# Altium schematic sheet top_level.SchDoc: Test
size A4; DrawnBy: Łukasz Przeniosło; Organization: Zachodniopomorski; Address1: Uniwersytet Technologiczny; Address2: w Szczecinie; Address3: Wydział Elektryczny; DocumentNumber: 1; Revision: 1.0; SheetNumber: 1; SheetTotal: 8
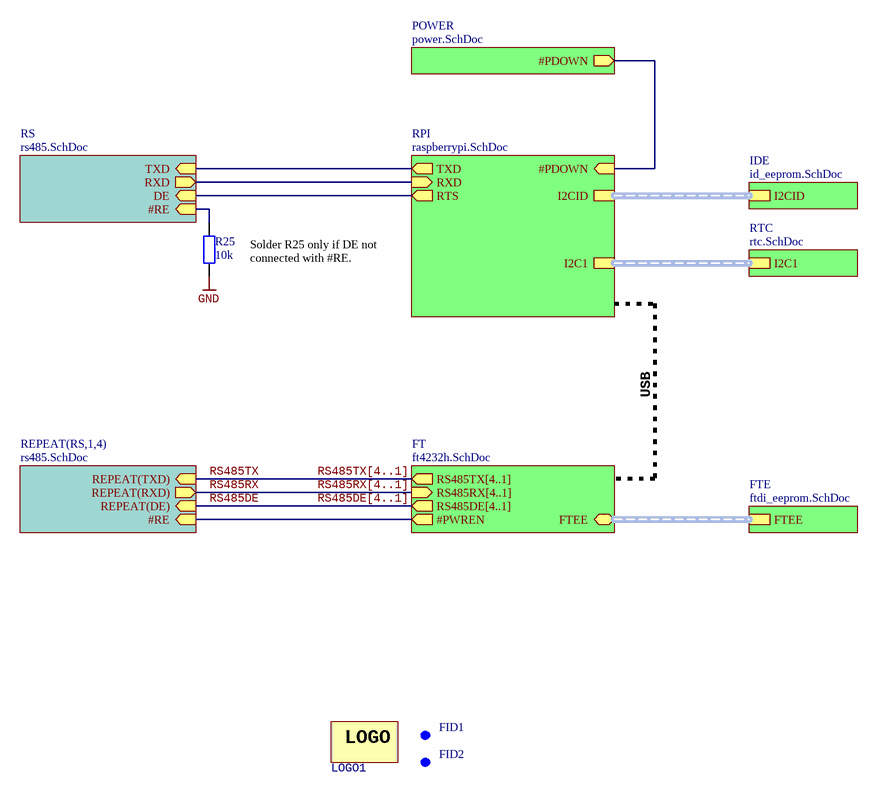
[diagram p0: top_level.SchDoc]

## Parts
FID1  Fiducial  [Fid Round]  (value not drawn)  (no BOM)
FID2  Fiducial  [Fid Round]  (value not drawn)  (no BOM)
LOGO1  Logo  [LOGO_BEMKO]  (value not drawn)
R25  10k  [RESC1005N]

## Sub-sheets
FT = ft4232h.SchDoc: RS485TX[4..1] (out), RS485RX[4..1] (in), #PWREN (out), FTEE (harness FTEE), RS485DE[4..1] (out)
FTE = ftdi_eeprom.SchDoc: FTEE (harness FTEE)
IDE = id_eeprom.SchDoc: I2CID (harness I2CID)
POWER = power.SchDoc: #PDOWN (out)
REPEAT(RS,1,4) = rs485.SchDoc: REPEAT(TXD) (in), REPEAT(RXD) (out), REPEAT(DE) (in), #RE (in)
RPI = raspberrypi.SchDoc: I2CID (harness I2CID), I2C1 (harness I2C1), TXD (out), RXD (in), RTS (out), #PDOWN (in)
RS = rs485.SchDoc: TXD (in), RXD (out), DE (in), #RE (in)
RTC = rtc.SchDoc: I2C1 (harness I2C1)

## Nets
GND: R25.1
RS485DE: sheet REPEAT(RS,1,4)/REPEAT(DE)
RS485RX: sheet REPEAT(RS,1,4)/REPEAT(RXD)
RS485TX: sheet REPEAT(RS,1,4)/REPEAT(TXD)
NetR25_2: R25.2 ; sheet RS/#RE
(unnamed): sheet RPI/TXD, sheet RS/TXD
(unnamed): sheet RPI/RXD, sheet RS/RXD
(unnamed): sheet RPI/RTS, sheet RS/DE
(unnamed): sheet RPI/#PDOWN, sheet POWER/#PDOWN
(unnamed): sheet FT/#PWREN, sheet REPEAT(RS,1,4)/#RE

## Buses and harness runs
bus RS485DE[4..1] = sheet FT/RS485DE[4..1]
bus RS485RX[4..1] = sheet FT/RS485RX[4..1]
bus RS485TX[4..1] = sheet FT/RS485TX[4..1]
harness sheet FT/FTEE = sheet FTE/FTEE
harness sheet IDE/I2CID = sheet RPI/I2CID
harness sheet RPI/I2C1 = sheet RTC/I2C1

## Notes on the sheet
- (near R25) Solder R25 only if DE not connected with #RE.
- USB
- Title
- Size:
- Date:
- A4
- Author:
- Time:
- Sheet
- of
- File:
- (in symbol Logo) LOGO

## Library data of the parts
FID1 FID2 = FID ROUND: round fiducial
R25 = Resistor: Power: 0W; Tolerance: 1%; Value: 10k